# Altium project Sub1GHz_wireless_system.PrjPcb
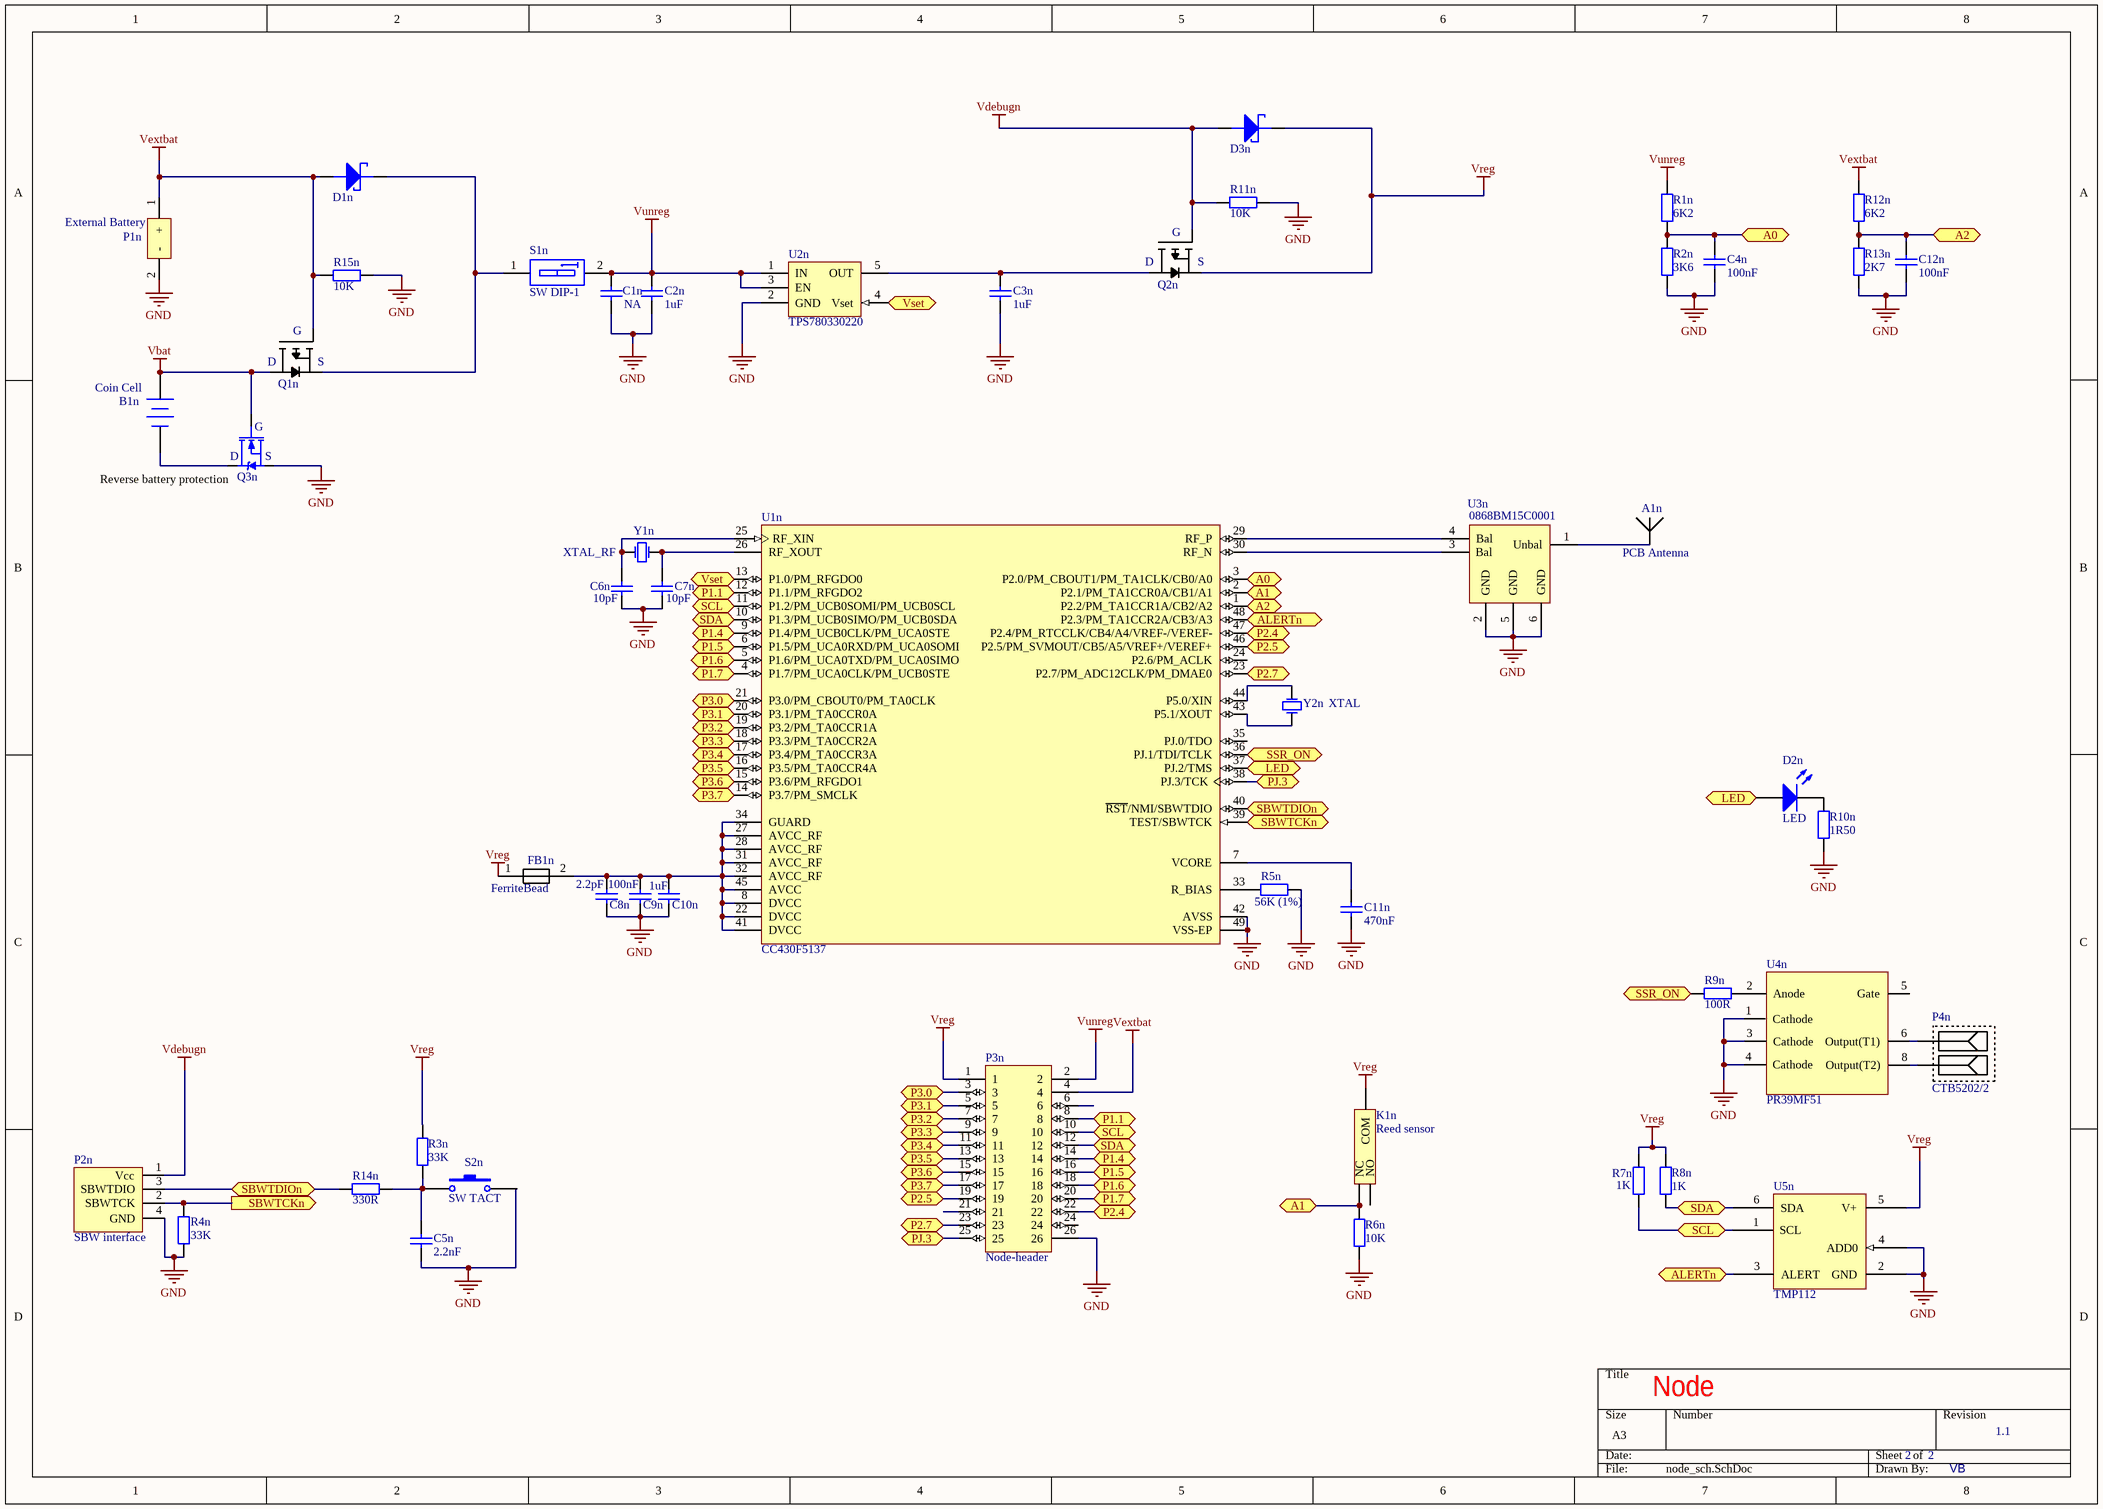
[diagram p0: node_sch.SchDoc]
2 sheets, 99 parts. Net scope: flat (ports and power ports of the same name join across sheets).
Board files: node_pcb.PcbDoc, concentrator_pcb.PcbDoc
Sheets:
  node_sch.SchDoc
  concentrator_sch.SchDoc

## Sheet node_sch.SchDoc: Node
size A3; DrawnBy: VB; Revision: 1.1; SheetNumber: 2; SheetTotal: 2

### Parts
A1n  PCB Antenna  [TI_Monopole_PCB_Antenna]
B1n  Coin Cell  [COIN_CELL_HOLDER_JBH24]
C1n  NA  [0805_CAP]
C2n  1uF  [0805_CAP]
C3n  1uF  [0805_CAP]
C4n  100nF  [0805_CAP]
C5n  2.2nF  [0805_CAP]
C6n  10pF  [0805_CAP]
C7n  10pF  [0805_CAP]
C8n  2.2pF  [0805_CAP]
C9n  100nF  [0805_CAP]
C10n  1uF  [0805_CAP]
C11n  470nF  [0805_CAP]
C12n  100nF  [0805_CAP]
D1n  Schottky  [SOD323-F]  (value not drawn)
D2n  LED  [0805_LED_RED]
D3n  Schottky  [SOD323-F]  (value not drawn)
FB1n  FerriteBead  [0805_RES]
K1n  Reed sensor  [REED_SENSOR_SMD]
P1n  External Battery  [DF3A-2P-2DS]
P2n  SBW interface  [DF3A-4P-2DS]
P3n  Node-header  [FH26p2pitch_thru-hole]
P4n  CTB5202/2  [ScrewTerminal2p5pitch_thru-hole]
Q1n  Pin: D  Pin: G  Pin: S  [SOT23]  (hidden comment: P-MOS)
Q2n  Pin: S  Pin: D  Pin: G  [SOT23]  (hidden comment: P-MOS)
Q3n  pin: D  pin: S  pin: G  [SOT23]  (hidden comment: N-MOS)
R1n  6K2  [0805_RES]
R2n  3K6  [0805_RES]
R3n  33K  [0805_RES]
R4n  33K  [0805_RES]
R5n  56K (1%)  [0805_RES]
R6n  10K  [0805_RES]
R7n  1K  [0805_RES]
R8n  1K  [0805_RES]
R9n  100R  [0805_RES]
R10n  1R50  [0805_RES]
R11n  10K  [0805_RES]
R12n  6K2  [0805_RES]
R13n  2K7  [0805_RES]
R14n  330R  [0805_RES]
R15n  10K  [0805_RES]
S1n  SW DIP-1  [SW_DIP(1way)]
S2n  SW TACT  [SW-TACT]
U1n  CC430F5137  [TI-RGZ48-4100X4100TP_N]
U2n  TPS780330220  [SOT5]
U3n  0868BM15C0001  [JT_Balun]
U4n  PR39MF51  [SSR_SMT_LEAD]
U5n  TMP112  [SOT563]
Y1n  XTAL_RF  [xtal_rf]
Y2n  XTAL  [XTAL]

### Ports
A0 (bidir), A1 (bidir), A2 (bidir), ALERTn (bidir), LED (bidir), P1.1 (bidir), P1.4 (bidir), P1.5 (bidir), P1.6 (bidir), P1.7 (bidir), P2.4 (bidir), P2.5 (bidir), P2.7 (bidir), P3.0 (bidir), P3.1 (bidir), P3.2 (bidir), P3.3 (bidir), P3.4 (bidir), P3.5 (bidir), P3.6 (bidir), P3.7 (bidir), PJ.3 (bidir), SBWTCKn (out), SBWTDIOn (bidir), SCL (bidir), SDA (bidir), SSR_ON (bidir), Vset (bidir)

### Nets
GND: C1n.1 C2n.1 C3n.1 C4n.1 C5n.1 C6n.1 C7n.1 C8n.1 C9n.2 C10n.1 C11n.1 C12n.1 P1n.2(-) P2n.4(GND) P3n.26 Q3n.2(S) R2n.1 R4n.1 R5n.2 R6n.1 R10n.1 R11n.1 R13n.1 R15n.2 S2n.2 U1n.42(AVSS) U1n.49(VSS-EP) U2n.2(GND) U3n.2(GND) U3n.5(GND) U3n.6(GND) U4n.1(Cathode) U4n.3(Cathode) U4n.4(Cathode) U5n.2(GND) U5n.4(ADD0)
Vbat: B1n.1(+) Q1n.3(D) Q3n.1(G)
Vdebugn: D3n.2(ANODE) P2n.1(Vcc) Q2n.1(G) R11n.2
Vextbat: D1n.2(ANODE) P1n.1(+) P3n.4 Q1n.1(G) R12n.2 R15n.1
Vreg: D3n.1(CATHODE) FB1n.1 K1n.1(COM) P3n.1 Q2n.2(S) R3n.2 R7n.2 R8n.2 U5n.5(V+)
Vunreg: C1n.2 C2n.2 P3n.2 R1n.2 S1n.2(B1) U2n.1(IN) U2n.3(EN)
NetA1n_1: A1n.1(ANT) U3n.1(Unbal)
NetB1n_2: B1n.2(-) Q3n.3(D)
NetC3n_2: C3n.2 Q2n.3(D) U2n.5(OUT)
NetC4n_2: C4n.2 R1n.1 R2n.2 U1n.3(P2.0/PM_CBOUT1/PM_TA1CLK/CB0/A0) ; port A0
NetC5n_2: C5n.2 R3n.1 R14n.2 S2n.1
NetC6n_2: C6n.2 U1n.25(RF_XIN) Y1n.1(OSC1)
NetC7n_2: C7n.2 U1n.26(RF_XOUT) Y1n.3(OSC2)
NetC8n_2: C8n.2 C9n.1 C10n.2 FB1n.2 U1n.8(DVCC) U1n.22(DVCC) U1n.27(AVCC_RF) U1n.28(AVCC_RF) U1n.31(AVCC_RF) U1n.32(AVCC_RF) U1n.34(GUARD) U1n.41(DVCC) U1n.45(AVCC)
NetC11n_2: C11n.2 U1n.7(VCORE)
NetC12n_2: C12n.2 R12n.1 R13n.2 U1n.1(P2.2/PM_TA1CCR1A/CB2/A2) ; port A2
NetD1n_1: D1n.1(CATHODE) Q1n.2(S) S1n.1(A1)
NetD2n_1: D2n.1(A) U1n.37(PJ.2/TMS) ; port LED
NetD2n_2: D2n.2(K) R10n.2
NetK1n_2: K1n.2(NC) R6n.2 U1n.2(P2.1/PM_TA1CCR0A/CB1/A1) ; port A1
NetP2n_2: P2n.2(SBWTCK) R4n.2 U1n.39(TEST/SBWTCK) ; port SBWTCKn
NetP2n_3: P2n.3(SBWTDIO) R14n.1 U1n.40(~{RST}/NMI/SBWTDIO) ; port SBWTDIOn
NetP3n_3: P3n.3 U1n.21(P3.0/PM_CBOUT0/PM_TA0CLK) ; port P3.0
NetP3n_5: P3n.5 U1n.20(P3.1/PM_TA0CCR0A) ; port P3.1
NetP3n_7: P3n.7 U1n.19(P3.2/PM_TA0CCR1A) ; port P3.2
NetP3n_8: P3n.8 U1n.12(P1.1/PM_RFGDO2) ; port P1.1
NetP3n_9: P3n.9 U1n.18(P3.3/PM_TA0CCR2A) ; port P3.3
NetP3n_10: P3n.10 R7n.1 U1n.11(P1.2/PM_UCB0SOMI/PM_UCB0SCL) U5n.1(SCL) ; port SCL
NetP3n_11: P3n.11 U1n.17(P3.4/PM_TA0CCR3A) ; port P3.4
NetP3n_12: P3n.12 R8n.1 U1n.10(P1.3/PM_UCB0SIMO/PM_UCB0SDA) U5n.6(SDA) ; port SDA
NetP3n_13: P3n.13 U1n.16(P3.5/PM_TA0CCR4A) ; port P3.5
NetP3n_14: P3n.14 U1n.9(P1.4/PM_UCB0CLK/PM_UCA0STE) ; port P1.4
NetP3n_15: P3n.15 U1n.15(P3.6/PM_RFGDO1) ; port P3.6
NetP3n_16: P3n.16 U1n.6(P1.5/PM_UCA0RXD/PM_UCA0SOMI) ; port P1.5
NetP3n_17: P3n.17 U1n.14(P3.7/PM_SMCLK) ; port P3.7
NetP3n_18: P3n.18 U1n.5(P1.6/PM_UCA0TXD/PM_UCA0SIMO) ; port P1.6
NetP3n_19: P3n.19 U1n.46(P2.5/PM_SVMOUT/CB5/A5/VREF+/VEREF+) ; port P2.5
NetP3n_20: P3n.20 U1n.4(P1.7/PM_UCA0CLK/PM_UCB0STE) ; port P1.7
NetP3n_22: P3n.22 U1n.47(P2.4/PM_RTCCLK/CB4/A4/VREF-/VEREF-) ; port P2.4
NetP3n_23: P3n.23 U1n.23(P2.7/PM_ADC12CLK/PM_DMAE0) ; port P2.7
NetP3n_25: P3n.25 U1n.38(PJ.3/TCK) ; port PJ.3
NetP4n_1: P4n.1 U4n.8(Output(T2))
NetP4n_2: P4n.2 U4n.6(Output(T1))
NetR5n_1: R5n.1 U1n.33(R_BIAS)
NetR9n_1: R9n.1 U1n.36(PJ.1/TDI/TCLK) ; port SSR_ON
NetR9n_2: R9n.2 U4n.2(Anode)
NetU1n_13: U1n.13(P1.0/PM_RFGDO0) U2n.4(Vset) ; port Vset
NetU1n_29: U1n.29(RF_P) U3n.4(Bal)
NetU1n_30: U1n.30(RF_N) U3n.3(Bal)
NetU1n_43: U1n.43(P5.1/XOUT) Y2n.1(OSC1)
NetU1n_44: U1n.44(P5.0/XIN) Y2n.2(OSC2)
NetU1n_48: U1n.48(P2.3/PM_TA1CCR2A/CB3/A3) U5n.3(ALERT) ; port ALERTn

Not connected (* = marked no-connect by the designer): K1n 3(NO); P3n 6 21 24; U1n 24(P2.6/PM_ACLK) 35(PJ.0/TDO); U4n 5(Gate)

### Notes on the sheet
- (near Q3n) Reverse battery protection

### Library data of the parts
A1n = PCB-Antenna: TI Monopole PCB Antenna at 868MHz operating frequency; Details: Low cost, medium size PCB antenna solution by Texas Instruments. See details: DN024 de
B1n = Coin_Cell: Represents a 24,5mm diameter coin cell battery (holder); Supplier: Farnell: 1365934; Type: JBH24
C1n C2n C3n C4n C5n C6n C7n C8n C10n C12n = Capacitor
  C1n: Value: NA
  C2n C3n C10n: Value: 1uF
  C4n C12n: Value: 100nF
  C5n: Value: 2.2nF
  C6n C7n: Value: 10pF
  C8n: Value: 2.2pF
C9n C11n = CAP: Capacitor
  C9n: Value: 100nF
  C11n: Value: 470nF
D1n D3n = Schottky: NXP - 1PS76SB10, SCHOTTKY RECT 30V 0.2A SOD323; Supplier: Lomex 83-02-04
D2n = LED: Typical GaAs LED
FB1n = FerriteBead: Ferrite Bead
K1n = Reed-Sensor: Reed sensor for proximity sensing; Type/Supplier: ORT551 / lomex: 42-01-87; Type/Supplier: MK15-B-2-OE  / 1079484
P1n = ExtBatConnector: Simple 2 trhu-hole connection for extra batteries
P2n = SBW-interface: 4 pole connector for debugging and programming; Supplier: Farnell: 1711329; Type: MOLEX - 87438-0443
P3n = Node-header: Female Header of the node pi 13x2 GPIO connector
P4n = CTB5202/2: 2 Pole Screw Terminal; Supplier: Farnell: 1717001
Q1n Q2n = P-MOS: irlml6401, P CH, -12V, 4A, SOT23; Supplier: Ebay
Q3n = N-MOS: FDV301N, N CH, 25V, 0.22A, SOT23; Supplier: Lomex: 86-03-44
R1n R2n R3n R4n R5n R6n R7n R8n R9n R12n R13n = RES: Resistor
  R1n R12n: Value: 6K2
  R2n: Value: 3K6
  R3n R4n: Value: 33K
  R5n: Value: 56K (1%)
  R6n: Value: 10K
  R7n R8n: Value: 1K
  R9n: Value: 100R
  R13n: Value: 2K7
R10n R11n R14n R15n = Resistor
  R10n: Value: 1R50
  R11n R15n: Value: 10K
  R14n: Value: 330R
S1n = SW DIP-1: DIP Switch, 1 Position; PackageReference: DIP-1 pole; Supplier: Farnell: 1960892
S2n = SW-TACT: Low profile, miniature tact switch; PackageDescription: Switch; 2 Leads; Supplier: Farnell: 1633006
U1n = CC430F5137IRGZR: 20 MHz MSP430 SoC with RF Core with 32 KB Flash, 4096 B SRAM and 30 GPIOs, -40 to 85 degC, 48-pin QFN (RGZ), Green (RoHS & no Sb/Br); Manufacturer: Texas Instruments; ADC: Yes; ADC Channels: 6; DMA: 3; Flash(KB): 32; Frequency(MHz): 20; GPIO: 30; Multiplier: 32x32; SRAM(B): 4096; SubFamily: RF SoC Series; Timers - 16-bit: 2; USCI_A (UART/LIN/IrDA/SPI): 1; DatasheetVersion: SLAS554F; PackageVersion: 4204101/F; PackageReference: RGZ48-4100X4100TP; PackageDescription: 48-Pin Plastic Flat Pack, Body 7 x 7 mm, Pitch 0.5 mm; Supplier 1: Digi-Key; Supplier Part Number 1: 296-27420-2-ND; Supplier 2: Digi-Key; Supplier Part Number 2: 296-27420-1-ND; Supplier 3: Digi-Key; Supplier Part Number 3: 296-27420-6-ND; Supplier 4: Newark; Supplier Part Number 4: 68R5912; Supplier 5: Mouser; Supplier Part Number 5: 595-CC430F5137IRGZR; Brown Out Reset: Yes; Comparators: Yes; Eco-Plan: Green (RoHS & no Sb/Br); Real-Time Clock: Yes; SVS: Yes; Temp Sensor: Yes; USCI_B (I2C & SPI): 1; Watchdog: Yes; Mounting Technology: Surface Mount; Code_JEDEC: MO-220; PartNumber: CC430F5137IRGZR; ComponentLink1Description: Manufacturer URL; ComponentLink1URL: http://www.ti.com/; ComponentLink2Description: Datasheet; ComponentLink2URL: http://www.ti.com/general/docs/lit/getliterature.tsp?genericPartNumber=CC430F5137&fileType=pdf; ComponentLink3Description: Package Specification; ComponentLink3URL: http://www.ti.com/lit/ds/symlink/sn75dp139.pdf; Supplier 6: TI Sample (CC430F5137IRGZR)
U2n = TPS780330220: LDO with 2.2V fix output; Vinput: 2.2 - 5.5V; Supplier: TI Sample
U3n = 0868BM15C0001: 868MHz Impedance Matched/Balun/BPF Integrated Component for T.I. CC110X, CC430, etc.; Manufacturer: Johanson Technology; PackageReference: 0805; Supplier 1: Farnell; Mounting Technology: Surface Mount; PartNumber: 0868BM15C0001
U4n = PR39MF51: PR39MF51 SSR, 1.2A; Supplier: Farnell: 1618487
U5n = TMP112: Temp sensor (serial interface, 0.5 C resolution, low supply voltage); Vcc range: 1.4 - 3.6V; Supplier: TI sample (TMP112AIDRLT)
Y1n = XTAL_RF: Crystal Oscillator; Published: 8-Jun-2000; LatestRevisionDate: 17-Jul-2002; LatestRevisionNote: Re-released for DXP Platform.; PackageReference: R38; Publisher: Altium Limited; PackageDescription: Crystal, Thru-Hole; 2 Leads; Body 3.1 x 8.2 mm (Dia.xH); Supplier: Farnell: 1841998  (26M); Supplier: Lomex: 40-02-49 (32768Hz)
Y2n = XTAL: Crystal Oscillator; Published: 8-Jun-2000; LatestRevisionDate: 17-Jul-2002; LatestRevisionNote: Re-released for DXP Platform.; PackageReference: R38; Publisher: Altium Limited; PackageDescription: Crystal, Thru-Hole; 2 Leads; Body 3.1 x 8.2 mm (Dia.xH); Supplier: Farnell: 1841998  (26M); Supplier: Lomex: 40-02-49 (32768Hz)

## Sheet concentrator_sch.SchDoc: Concentrator
size A3; DrawnBy: VB; Revision: 1.1; SheetNumber: 1; SheetTotal: 2
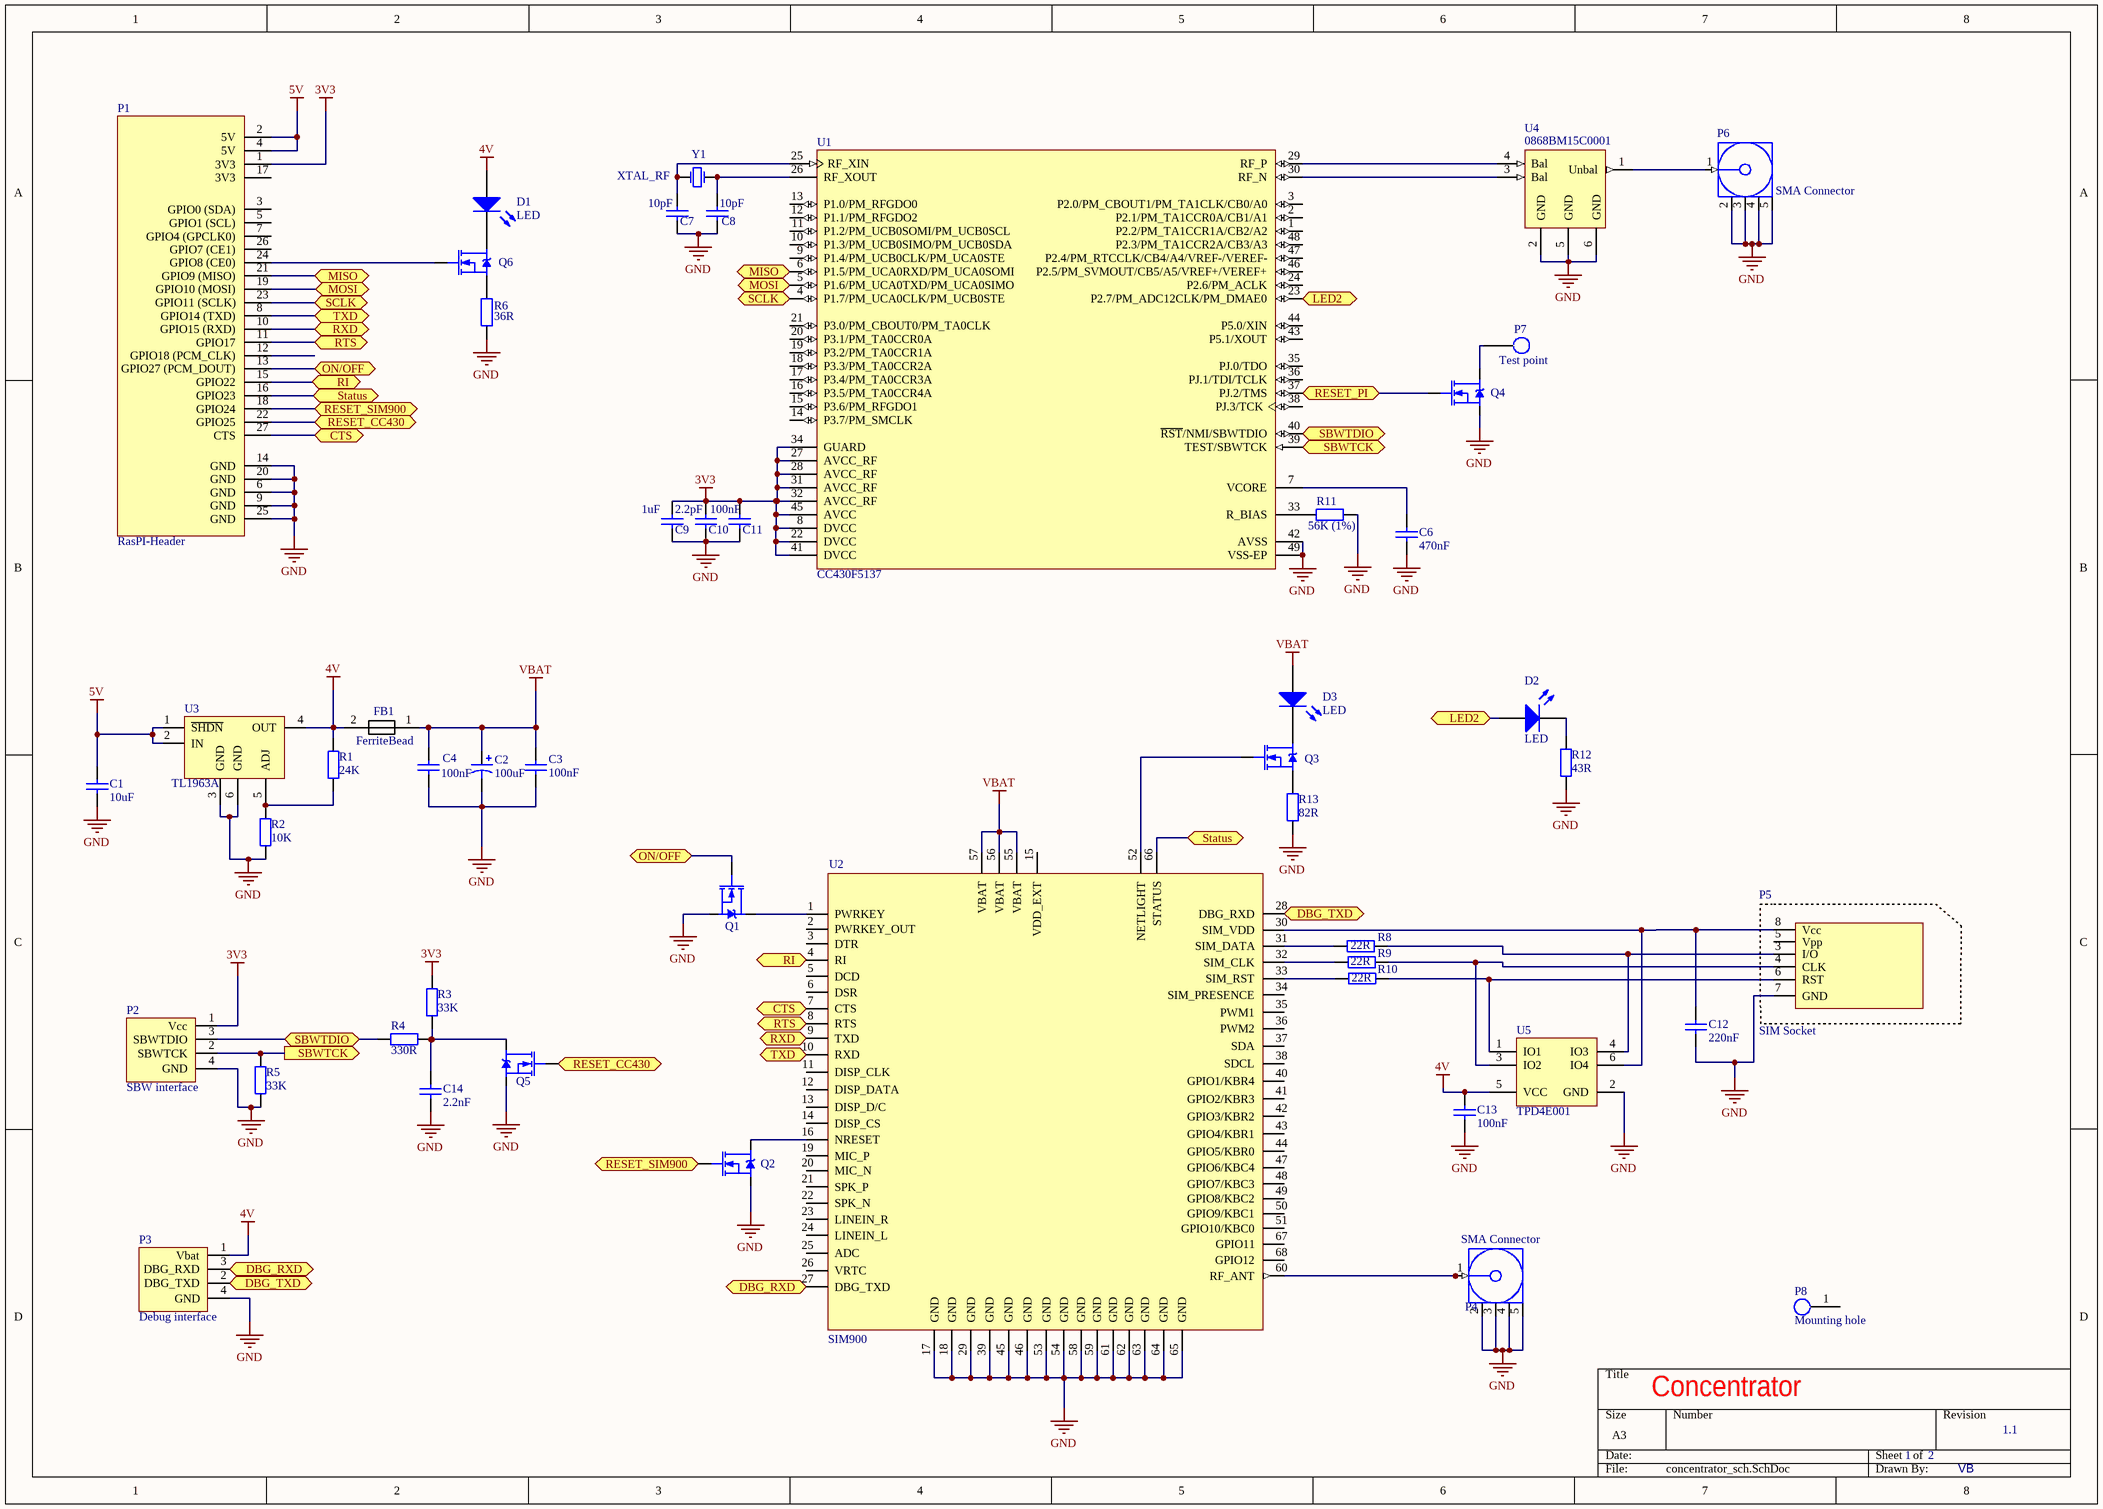
[diagram p1: concentrator_sch.SchDoc]

### Parts
C1  10uF  [0805_CAP]
C2  100uF  [3528_B]
C3  100nF  [0805_CAP]
C4  100nF  [0805_CAP]
C6  470nF  [0805_CAP]
C7  10pF  [0805_CAP]
C8  10pF  [0805_CAP]
C9  1uF  [0805_CAP]
C10  2.2pF  [0805_CAP]
C11  100nF  [0805_CAP]
C12  220nF  [0805_CAP]
C13  100nF  [0805_CAP]
C14  2.2nF  [0805_CAP]
D1  LED  [0805_LED_BLUE]
D2  LED  [0805_LED_GREEN]
D3  LED  [0805_LED_RED]
FB1  FerriteBead  [0805_RES]
P1  RasPI-Header  [FH26p254pitch_thru-hole]
P2  SBW interface  [DF3A-4P-2DS]
P3  Debug interface  [TESTPOINT4]
P4  SMA Connector  [SMA_Connector _Right_Angle]
P5  SIM Socket  [SIM_Card_Socket_Amphenol]
P6  SMA Connector  [SMA_Connector _Right_Angle]
P7  Test point  [TestPoint]
P8  Mounting hole  [MountHole]
Q1  N-MOS  [SOT23]  (value not drawn)
Q2  N-MOS  [SOT23]  (value not drawn)
Q3  N-MOS  [SOT23]  (value not drawn)
Q4  N-MOS  [SOT23]  (value not drawn)
Q5  N-MOS  [SOT23]  (value not drawn)
Q6  N-MOS  [SOT23]  (value not drawn)
R1  24K  [0805_RES]
R2  10K  [0805_RES]
R3  33K  [0805_RES]
R4  330R  [0805_RES]
R5  33K  [0805_RES]
R6  36R  [0805_RES]
R8  22R  [0805_RES]
R9  22R  [0805_RES]
R10  22R  [0805_RES]
R11  56K (1%)  [0805_RES]
R12  43R  [0805_RES]
R13  82R  [0805_RES]
U1  CC430F5137  [TI-RGZ48-4100X4100TP_N]
U2  SIM900  [SIM900]
U3  TL1963A  [6SOT-223]
U4  0868BM15C0001  [JT_Balun]
U5  TPD4E001  [SC70-6]
Y1  XTAL_RF  [xtal_rf]

### Ports
CTS, DBG_RXD (bidir), DBG_TXD (bidir), LED2 (bidir), MISO (bidir), MOSI (bidir), ON/OFF, RESET_CC430, RESET_PI (bidir), RESET_SIM900, RI, RTS, RXD, SBWTCK (out), SBWTDIO (bidir), SCLK (bidir), Status (bidir), TXD

### Nets
3V3: C9.1 C10.2 C11.2 P1.1(3V3) P2.1(Vcc) R3.2 U1.8(DVCC) U1.22(DVCC) U1.27(AVCC_RF) U1.28(AVCC_RF) U1.31(AVCC_RF) U1.32(AVCC_RF) U1.34(GUARD) U1.41(DVCC) U1.45(AVCC)
4V: C13.2 D1.1(A) FB1.2 P3.1(Vbat) R1.2 U3.4(OUT) U5.5(VCC)
5V: C1.2 P1.2(5V) P1.4(5V) U3.1(~{SHDN}) U3.2(IN)
GND: C1.1 C2.2 C3.1 C4.1 C6.1 C7.1 C8.1 C9.2 C10.1 C11.1 C12.1 C13.1 C14.1 P1.6(GND) P1.9(GND) P1.14(GND) P1.20(GND) P1.25(GND) P2.4(GND) P3.4(GND) P4.2(GND) P4.3(GND) P4.4(GND) P4.5(GND) P5.7(GND) P6.2(GND) P6.3(GND) P6.4(GND) P6.5(GND) Q1.2(S) Q2.2(S) Q4.2(S) Q5.2(S) R2.1 R5.1 R6.1 R11.1 R12.1 R13.1 U1.42(AVSS) U1.49(VSS-EP) U2.17(GND) U2.18(GND) U2.29(GND) U2.39(GND) U2.45(GND) U2.46(GND) U2.53(GND) U2.54(GND) U2.58(GND) U2.59(GND) U2.61(GND) U2.62(GND) U2.63(GND) U2.64(GND) U2.65(GND) U3.3(GND) U3.6(GND) U4.2(GND) U4.5(GND) U4.6(GND) U5.2(GND)
Vbat: C2.1 C3.2 C4.2 D3.1(A) FB1.1 U2.55(VBAT) U2.56(VBAT) U2.57(VBAT)
NetC6_2: C6.2 U1.7(VCORE)
NetC7_2: C7.2 U1.25(RF_XIN) Y1.1(OSC1)
NetC8_2: C8.2 U1.26(RF_XOUT) Y1.3(OSC2)
NetC12_2: C12.2 P5.8(Vcc) U2.30(SIM_VDD) U5.6(IO4)
NetC14_2: C14.2 Q5.3(D) R3.1 R4.2
NetD1_2: D1.2(K) Q6.3(D)
NetD2_1: D2.1(A) U1.23(P2.7/PM_ADC12CLK/PM_DMAE0) ; port LED2
NetD2_2: D2.2(K) R12.2
NetD3_2: D3.2(K) Q3.3(D)
NetP1_8: P1.8(GPIO14_(TXD)) U2.10(RXD) ; port TXD
NetP1_10: P1.10(GPIO15_(RXD)) U2.9(TXD) ; port RXD
NetP1_11: P1.11(GPIO17) U2.8(RTS) ; port RTS
NetP1_13: P1.13(GPIO27_(PCM_DOUT)) Q1.1(G) ; port ON/OFF
NetP1_15: P1.15(GPIO22) U2.4(RI) ; port RI
NetP1_16: P1.16(GPIO23) U2.66(STATUS) ; port Status
NetP1_18: P1.18(GPIO24) Q2.1(G) ; port RESET_SIM900
NetP1_19: P1.19(GPIO10_(MOSI)) U1.5(P1.6/PM_UCA0TXD/PM_UCA0SIMO) ; port MOSI
NetP1_21: P1.21(GPIO9_(MISO)) U1.6(P1.5/PM_UCA0RXD/PM_UCA0SOMI) ; port MISO
NetP1_22: P1.22(GPIO25) Q5.1(G) ; port RESET_CC430
NetP1_23: P1.23(GPIO11_(SCLK)) U1.4(P1.7/PM_UCA0CLK/PM_UCB0STE) ; port SCLK
NetP1_24: P1.24(GPIO8_(CE0)) Q6.1(G)
NetP1_27: P1.27(CTS) U2.7(CTS) ; port CTS
NetP2_2: P2.2(SBWTCK) R5.2 U1.39(TEST/SBWTCK) ; port SBWTCK
NetP2_3: P2.3(SBWTDIO) R4.1 U1.40(~{RST}/NMI/SBWTDIO) ; port SBWTDIO
NetP3_2: P3.2(DBG_TXD) U2.28(DBG_RXD) ; port DBG_TXD
NetP3_3: P3.3(DBG_RXD) U2.27(DBG_TXD) ; port DBG_RXD
NetP4_1: P4.1(Signal) U2.60(RF_ANT)
NetP5_3: P5.3(I/O) R8.2 U5.4(IO3)
NetP5_4: P5.4(CLK) R9.2 U5.3(IO2)
NetP5_6: P5.6(RST) R10.2 U5.1(IO1)
NetP6_1: P6.1(Signal) U4.1(Unbal)
NetP7_1: P7.1 Q4.3(D)
NetQ1_3: Q1.3(D) U2.1(PWRKEY)
NetQ2_3: Q2.3(D) U2.16(NRESET)
NetQ3_1: Q3.1(G) U2.52(NETLIGHT)
NetQ3_2: Q3.2(S) R13.2
NetQ4_1: Q4.1(G) U1.37(PJ.2/TMS) ; port RESET_PI
NetQ6_2: Q6.2(S) R6.2
NetR1_1: R1.1 R2.2 U3.5(ADJ)
NetR8_1: R8.1 U2.31(SIM_DATA)
NetR9_1: R9.1 U2.32(SIM_CLK)
NetR10_1: R10.1 U2.33(SIM_RST)
NetR11_2: R11.2 U1.33(R_BIAS)
NetU1_29: U1.29(RF_P) U4.4(Bal)
NetU1_30: U1.30(RF_N) U4.3(Bal)

Not connected (* = marked no-connect by the designer): P1 3(GPIO0_(SDA)) 5(GPIO1_(SCL)) 7(GPIO4_(GPCLK0)) 12(GPIO18_(PCM_CLK)) 17(3V3) 26(GPIO7_(CE1)); P5 5(Vpp); P8 1; U1 1(P2.2/PM_TA1CCR1A/CB2/A2) 2(P2.1/PM_TA1CCR0A/CB1/A1) 3(P2.0/PM_CBOUT1/PM_TA1CLK/CB0/A0) 9(P1.4/PM_UCB0CLK/PM_UCA0STE) 10(P1.3/PM_UCB0SIMO/PM_UCB0SDA) 11(P1.2/PM_UCB0SOMI/PM_UCB0SCL) 12(P1.1/PM_RFGDO2) 13(P1.0/PM_RFGDO0) 14(P3.7/PM_SMCLK) 15(P3.6/PM_RFGDO1) 16(P3.5/PM_TA0CCR4A) 17(P3.4/PM_TA0CCR3A) 18(P3.3/PM_TA0CCR2A) 19(P3.2/PM_TA0CCR1A) 20(P3.1/PM_TA0CCR0A) 21(P3.0/PM_CBOUT0/PM_TA0CLK) 24(P2.6/PM_ACLK) 35(PJ.0/TDO) 36(PJ.1/TDI/TCLK) 38(PJ.3/TCK) 43(P5.1/XOUT) 44(P5.0/XIN) 46(P2.5/PM_SVMOUT/CB5/A5/VREF+/VEREF+) 47(P2.4/PM_RTCCLK/CB4/A4/VREF-/VEREF-) 48(P2.3/PM_TA1CCR2A/CB3/A3); U2 2(PWRKEY_OUT) 3(DTR) 5(DCD) 6(DSR) 11(DISP_CLK) 12(DISP_DATA) 13(DISP_D/C) 14(DISP_CS) 15(VDD_EXT) 19(MIC_P) 20(MIC_N) 21(SPK_P) 22(SPK_N) 23(LINEIN_R) 24(LINEIN_L) 25(ADC) 26(VRTC) 34(SIM_PRESENCE) 35(PWM1) 36(PWM2) 37(SDA) 38(SDCL) 40(GPIO1/KBR4) 41(GPIO2/KBR3) 42(GPIO3/KBR2) 43(GPIO4/KBR1) 44(GPIO5/KBR0) 47(GPIO6/KBC4) 48(GPIO7/KBC3) 49(GPIO8/KBC2) 50(GPIO9/KBC1) 51(GPIO10/KBC0) 67(GPIO11) 68(GPIO12)

### Library data of the parts
C1 C3 C4 C6 C12-C14 = Capacitor
  C1: Value: 10uF
  C3 C4 C13: Value: 100nF
  C6: Value: 470nF
  C12: Value: 220nF
  C14: Value: 2.2nF
C2 = Cap-Elco: Polarized Capacitor; Value: 100uF
C7-C11 = CAP: Capacitor
  C7 C8: Value: 10pF
  C9: Value: 1uF
  C10: Value: 2.2pF
  C11: Value: 100nF
D1-D3 = LED: Typical GaAs LED
FB1 = FerriteBead: Ferrite Bead
P1 = RasPI-FHeader: Female Header of raspberry pi 13x2 GPIO connector
P2 = SBW-interface: as P2n on sheet node_sch; Supplier: Farnell: 1711329; Type: MOLEX - 87438-0443
P3 = Debug-interface: 4 pole connector for SIM900 serial debug communication; Supplier: Farnell: 1711329; Type: MOLEX - 87438-0443
P4 P6 = SMA-Connector: LRPS PCB Mount Connector, Thru-Hole; Supplier: Farnell: 2096224  / 2096223
P5 = SIM-Socket: SIM socket according to Assman A-SIM-08-06-C-003 model; Supplier: HEStore: 10026633
P7 = TestPoint
P8 = MountHole: Mounting hole - 2.9mm drilled diameter
Q1-Q6 = N-MOS: FDV301N, N CH, 25V, 0.22A, SOT23; Supplier: Lomex: 86-03-44
R1 R2 R6 R8-R10 R12 R13 = Resistor
  R1: Value: 24K
  R2: Value: 10K
  R6: Value: 36R
  R8-R10: Value: 22R
  R12: Value: 43R
  R13: Value: 82R
R3-R5 R11 = RES: Resistor
  R3 R5: Value: 33K
  R4: Value: 330R
  R11: Value: 56K (1%)
U1 = CC430F5137IRGZR: as U1n on sheet node_sch; DatasheetVersion: SLAS554F; PackageVersion: 4204101/F; PackageReference: RGZ48-4100X4100TP; PackageDescription: 48-Pin Plastic Flat Pack, Body 7 x 7 mm, Pitch 0.5 mm; Supplier 1: Digi-Key; Supplier Part Number 1: 296-27420-2-ND; Supplier 2: Digi-Key; Supplier Part Number 2: 296-27420-1-ND; Supplier 3: Digi-Key; Supplier Part Number 3: 296-27420-6-ND; Supplier 4: Newark; Supplier Part Number 4: 68R5912; Supplier 5: Mouser; Supplier Part Number 5: 595-CC430F5137IRGZR; Brown Out Reset: Yes; Comparators: Yes; Eco-Plan: Green (RoHS & no Sb/Br); Real-Time Clock: Yes; SVS: Yes; Temp Sensor: Yes; USCI_B (I2C & SPI): 1; Watchdog: Yes; Mounting Technology: Surface Mount; Code_JEDEC: MO-220; PartNumber: CC430F5137IRGZR; ComponentLink1Description: Manufacturer URL; ComponentLink1URL: http://www.ti.com/; ComponentLink2Description: Datasheet; ComponentLink2URL: http://www.ti.com/general/docs/lit/getliterature.tsp?genericPartNumber=CC430F5137&fileType=pdf; ComponentLink3Description: Package Specification; ComponentLink3URL: http://www.ti.com/lit/ds/symlink/sn75dp139.pdf; Supplier 6: TI Sample (CC430F5137IRGZR)
U2 = SIM900: SIM900 GSM modul; Supplier: TME
U3 = TL1963A: Adjustable LDO up to 1.5A; Supplier: TI sample
U4 = 0868BM15C0001: as U3n on sheet node_sch; PackageReference: 0805; Supplier 1: Farnell; Mounting Technology: Surface Mount; PartNumber: 0868BM15C0001
U5 = TPD4E001DCKR: Low-Capacitance + / - 15-kV ESD Protection Array for High-Speed Data Interfaces, 4 Channels, -40 to +85 degC, 6-pin SOT70 (DCK), Green (RoHS & no Sb/Br); Manufacturer: Texas Instruments; 1394 / Firewire: TRUE; Breakdown Voltage(Min)(V): 11; IEC 61000-4-2 Air-Gap(+/- kV): 15; IEC 61000-4-2 Contact(+/- kV): 8; IO Capacitance(Typ)(pF): 1.5; SubFamily: ESD Solution; DatasheetVersion: SLLS682G; PackageVersion: revG, Jan-2007; PackageReference: DCK6; PackageDescription: 6-Pin Plastic Small-Outline Package, 2 x 1.3 mm Body, 0.65 mm Pitch, 2.1 mm Lead Span; Supplier 1: Digi-Key; Supplier Part Number 1: 296-28779-2-ND; Supplier 2: Digi-Key; Supplier Part Number 2: 296-28779-1-ND; Supplier 3: Digi-Key; Supplier Part Number 3: 296-28779-6-ND; Supplier 4: Newark; Supplier Part Number 4: 48T4664; Supplier 5: Mouser; Supplier Part Number 5: 595-TPD4E001DCKR; Eco-Plan: Green (RoHS & no Sb/Br); IO Leakage Current(nA): 1.5; Serial ATA / eSATA: TRUE; USB High Speed: TRUE; Mounting Technology: Surface Mount; Code_JEDEC: MO-203-AB; PartNumber: TPD4E001DCKR; ComponentLink1Description: Datasheet; ComponentLink1URL: http://www.ti.com/general/docs/lit/getliterature.tsp?genericPartNumber=TPD4E001&fileType=pdf; ComponentLink2Description: URL Link1; ComponentLink2URL: SamplesURL:http://www.ti.com/product/tpd4e001#samples
Y1 = XTAL_RF: Crystal Oscillator; Published: 8-Jun-2000; LatestRevisionDate: 17-Jul-2002; LatestRevisionNote: Re-released for DXP Platform.; PackageReference: R38; Publisher: Altium Limited; PackageDescription: Crystal, Thru-Hole; 2 Leads; Body 3.1 x 8.2 mm (Dia.xH); Supplier: Farnell: 1841998  (26M); Supplier: Lomex: 40-02-49 (32768Hz)

## Nets that join several sheets
GND: node_sch (36 pins), concentrator_sch (62 pins)
Vbat: node_sch (B1n.1 Q1n.3 Q3n.1), concentrator_sch (8 pins)